# Altium schematic sheet Schematic_page1.SchDoc
size 420 x 297 mm; Date: 15.08.2020; Author: Дубатовка В.В.; SheetNumber: 1; SheetTotal: 3; Scale: 1:1
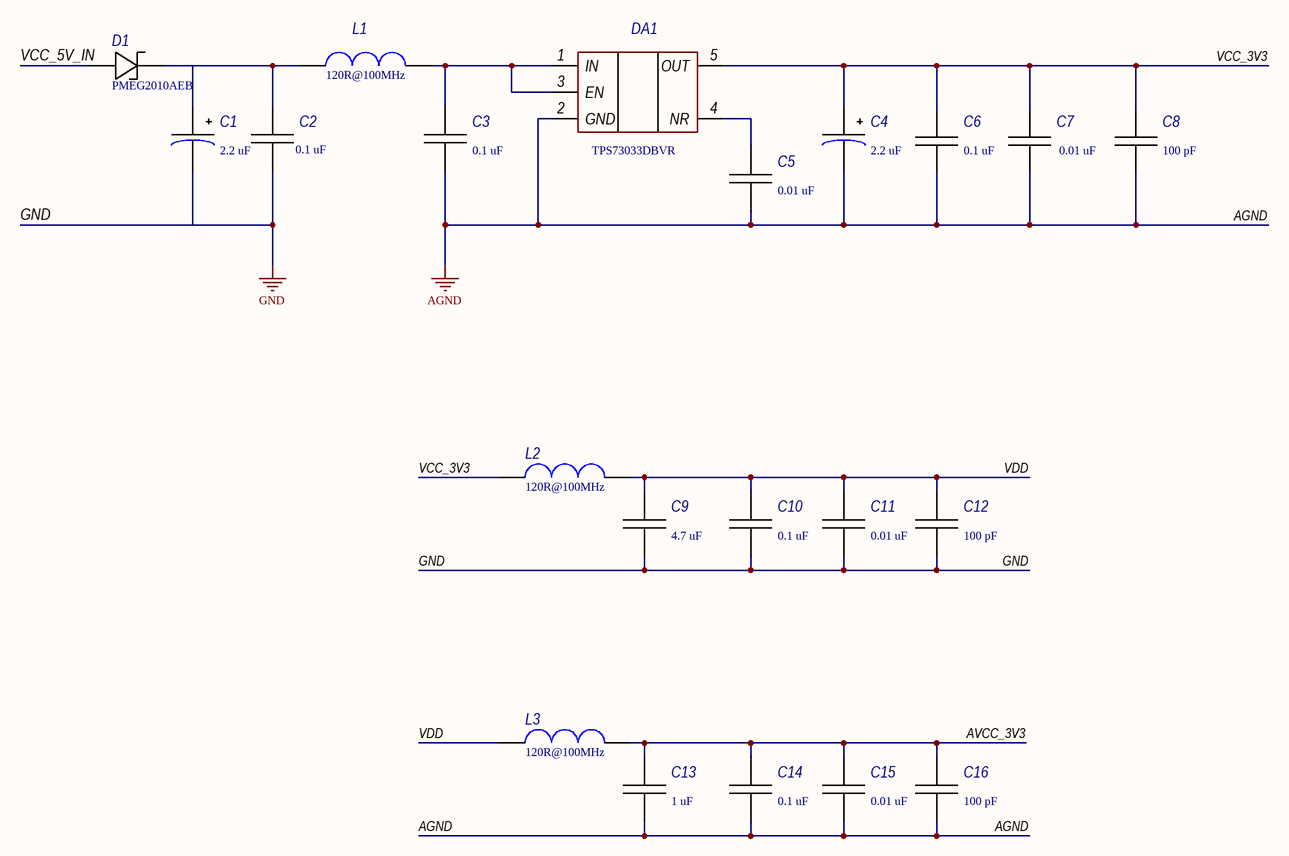
[diagram p0: Schematic_page1.SchDoc]

## Parts
C1  2.2 uF  [TANT-A]
C2  0.1 uF  [C0603]
C3  0.1 uF  [C0603]
C4  2.2 uF  [TANT-A]
C5  0.01 uF  [C0603]
C6  0.1 uF  [C0603]
C7  0.01 uF  [C0603]
C8  100 pF  [C0603]
C9  4.7 uF  [C0603]
C10  0.1 uF  [C0603]
C11  0.01 uF  [C0603]
C12  100 pF  [C0603]
C13  1 uF  [C0603]
C14  0.1 uF  [C0603]
C15  0.01 uF  [C0603]
C16  100 pF  [C0603]
D1  PMEG2010AEB  [SOD-523]
DA1  TPS73033DBVR  [SOT-23-5]
L1  120R@100MHz  [IND1206]
L2  120R@100MHz  [IND1206]
L3  120R@100MHz  [IND1206]

## Nets
AGND: C3.2 C4.2 C5.2 C6.2 C7.2 C8.2 C13.2 C14.2 C15.2 C16.2 DA1.2(GND)
GND: C1.2 C2.2 C9.2 C10.2 C11.2 C12.2
AVCC_3V3: C13.1 C14.1 C15.1 C16.1 L3.2
VCC_3V3: C4.1 C6.1 C7.1 C8.1 DA1.5(OUT) L2.1
VCC_5V_IN: D1.2
VDD: C9.1 C10.1 C11.1 C12.1 L2.2 L3.1
NetC1_1: C1.1 C2.1 D1.1 L1.1
NetC3_1: C3.1 DA1.1(IN) DA1.3(EN) L1.2
NetC5_1: C5.1 DA1.4(NR)

## Notes on the sheet
- Перв. примен.
- Справ. №
- Подп. и дата
- Инв. № дубл.
- Взам. инв. №
- Разраб.
- Изм.
- Лист
- № докум.
- Подп.
- Дата
- Лит.
- Масса
- Масштаб
- Пров.
- Т.контр.
- Листов
- Инв. № подл.
- Утв.
- Н.контр.
- 2.106-A3
- Копировал
- Формат А3

## Library data of the parts
C1 C4 = Capasitor_Tantalum: Value: 2.2 uF; Case: SMD A; HelpURL: https://www.chipdip.by/product0/12712
  C1: Manufacturer: -; Model: -
  C4: Manufacturer: *; Model: *
C2 C3 C5-C7 C10 C11 C14 C15 = Capasitor: Manufacturer: Murata Manufacturing; Model: X7R 10% 50V
  C2 C3 C6 C10 C14: Value: 0.1 uF; Case: С0603; HelpURL: https://www.chipdip.by/product/grm188r71h104k
  C5: Value: 0.01 uF; Case: C0603; HelpURL: https://www.chipdip.by/product/grm188r71h103k
  C7: Value: 0.01 uF; Case: С0603; HelpURL: https://www.chipdip.by/product/grm188r71h103k
  C11 C15: Value: 0.01 uF; Case: С0603; HelpURL: https://www.chipdip.by/product0/9000143994
C8 C12 C16 = Capasitor: Manufacturer: Murata Manufacturing; Model: NP0 5% 50V; Value: 100 pF; Case: С0603; HelpURL: https://www.chipdip.by/product/grm1885c1h101j
C9 C13 = Capasitor: Manufacturer: Murata Manufacturing; Model: X5R 10% 16V; Case: С0603
  C9: Value: 4.7 uF; HelpURL: https://www.chipdip.by/product0/9000193550
  C13: Value: 1 uF; HelpURL: https://www.chipdip.by/product/grm188r61c105k
D1 = Diode Schottky: Schottky Barrier Diodes, 1A to 1.5A, Nexperia; Model: PMEG2010AEB; Manufacturer: Nexperia; Case: SOD-523; HelpURL: https://www.chipdip.by/product/pmeg2010aeb.115
DA1 = TPS73033DBV: IC REG LINEAR 3.3V 200MA SOT 23-5; Manufacturer: Texas Instruments; Case: SOT-23-5; HelpURL: https://www.digikey.com/product-detail/en/texas-instruments/TPS73033DBVR/296-17580-1-ND/705377; Model: TPS73033DBVR
L1-L3 = Inductivity: Model: *; Manufacturer: *; HelpURL: *; Case: *; Value: 120R@100MHz